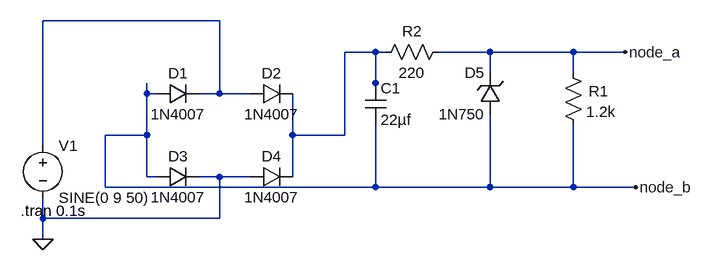
[diagram p0: schematic Draft3.asc]
Draft3.asc, the LTspice schematic file:
Version 4
SHEET 1 1144 680
WIRE 400 -96 128 -96
WIRE 640 -48 592 -48
WIRE 656 -48 640 -48
WIRE 816 -48 736 -48
WIRE 944 -48 816 -48
WIRE 1024 -48 944 -48
WIRE 816 -16 816 -48
WIRE 944 -16 944 -48
WIRE 640 0 640 -48
WIRE 288 16 288 0
WIRE 304 16 288 16
WIRE 400 16 400 -96
WIRE 400 16 368 16
WIRE 448 16 400 16
WIRE 640 16 640 0
WIRE 288 80 288 16
WIRE 288 80 224 80
WIRE 512 80 512 16
WIRE 592 80 592 -48
WIRE 592 80 512 80
WIRE 128 96 128 -96
WIRE 288 144 288 80
WIRE 304 144 288 144
WIRE 400 144 368 144
WIRE 448 144 400 144
WIRE 512 144 512 80
WIRE 224 160 224 80
WIRE 640 160 640 64
WIRE 640 160 224 160
WIRE 816 160 816 48
WIRE 816 160 640 160
WIRE 944 160 944 64
WIRE 944 160 816 160
WIRE 1040 160 944 160
WIRE 128 208 128 176
WIRE 400 208 400 144
WIRE 400 208 128 208
WIRE 128 240 128 208
FLAG 128 240 0
FLAG 1024 -48 node_a
FLAG 1040 160 node_b
SYMBOL voltage 128 80 R0
WINDOW 123 0 0 Left 0
WINDOW 39 0 0 Left 0
SYMATTR InstName V1
SYMATTR Value SINE(0 9 50)
SYMBOL diode 304 32 R270
WINDOW 0 32 32 VTop 2
WINDOW 3 0 32 VBottom 2
SYMATTR InstName D1
SYMATTR Value 1N4007
SYMBOL diode 448 32 R270
WINDOW 0 32 32 VTop 2
WINDOW 3 0 32 VBottom 2
SYMATTR InstName D2
SYMATTR Value 1N4007
SYMBOL diode 304 160 R270
WINDOW 0 32 32 VTop 2
WINDOW 3 0 32 VBottom 2
SYMATTR InstName D3
SYMATTR Value 1N4007
SYMBOL diode 448 160 R270
WINDOW 0 32 32 VTop 2
WINDOW 3 0 32 VBottom 2
SYMATTR InstName D4
SYMATTR Value 1N4007
SYMBOL res 928 -32 R0
WINDOW 0 40 44 Left 2
SYMATTR InstName R1
SYMATTR Value 1.2k
SYMBOL cap 624 0 R0
SYMATTR InstName C1
SYMATTR Value 22µf
SYMBOL res 752 -64 R90
WINDOW 0 0 56 VBottom 2
WINDOW 3 32 56 VTop 2
SYMATTR InstName R2
SYMATTR Value 220
SYMBOL zener 832 48 R180
WINDOW 0 24 64 Left 2
WINDOW 3 24 0 Left 2
SYMATTR InstName D5
SYMATTR Value 1N750
TEXT 94 196 Left 2 !.tran 0.1s

The netlist it stands for:
* Draft3.asc
V1 N001 0 SINE(0 9 50)
D1 node_b N001 1N4007
D2 N001 N002 1N4007
D3 node_b 0 1N4007
D4 0 N002 1N4007
R1 node_a node_b 1.2k
C1 N002 node_b 22µf
R2 node_a N002 220
D5 node_b node_a 1N750
.model D D
.lib standard.dio
.tran 0.1s
.backanno
.end

* Results of the author's LTspice run, read from the files saved beside the schematic
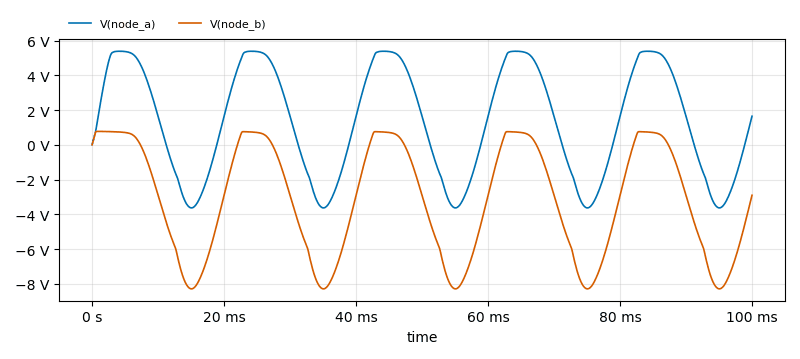
[diagram p1: Transient Analysis of Draft3.asc, plotted from the saved traces]
* Transient Analysis, 1 run:
*   V(node_a): min -3.632 V, max 5.385 V, average 1.349 V, rms 3.463 V, last 1.643 V
*   V(node_b): min -8.292 V, max 771.4 mV, average -3.148 V, rms 4.519 V, last -2.905 V